# Altium schematic sheet Sheet1.SchDoc
size A3
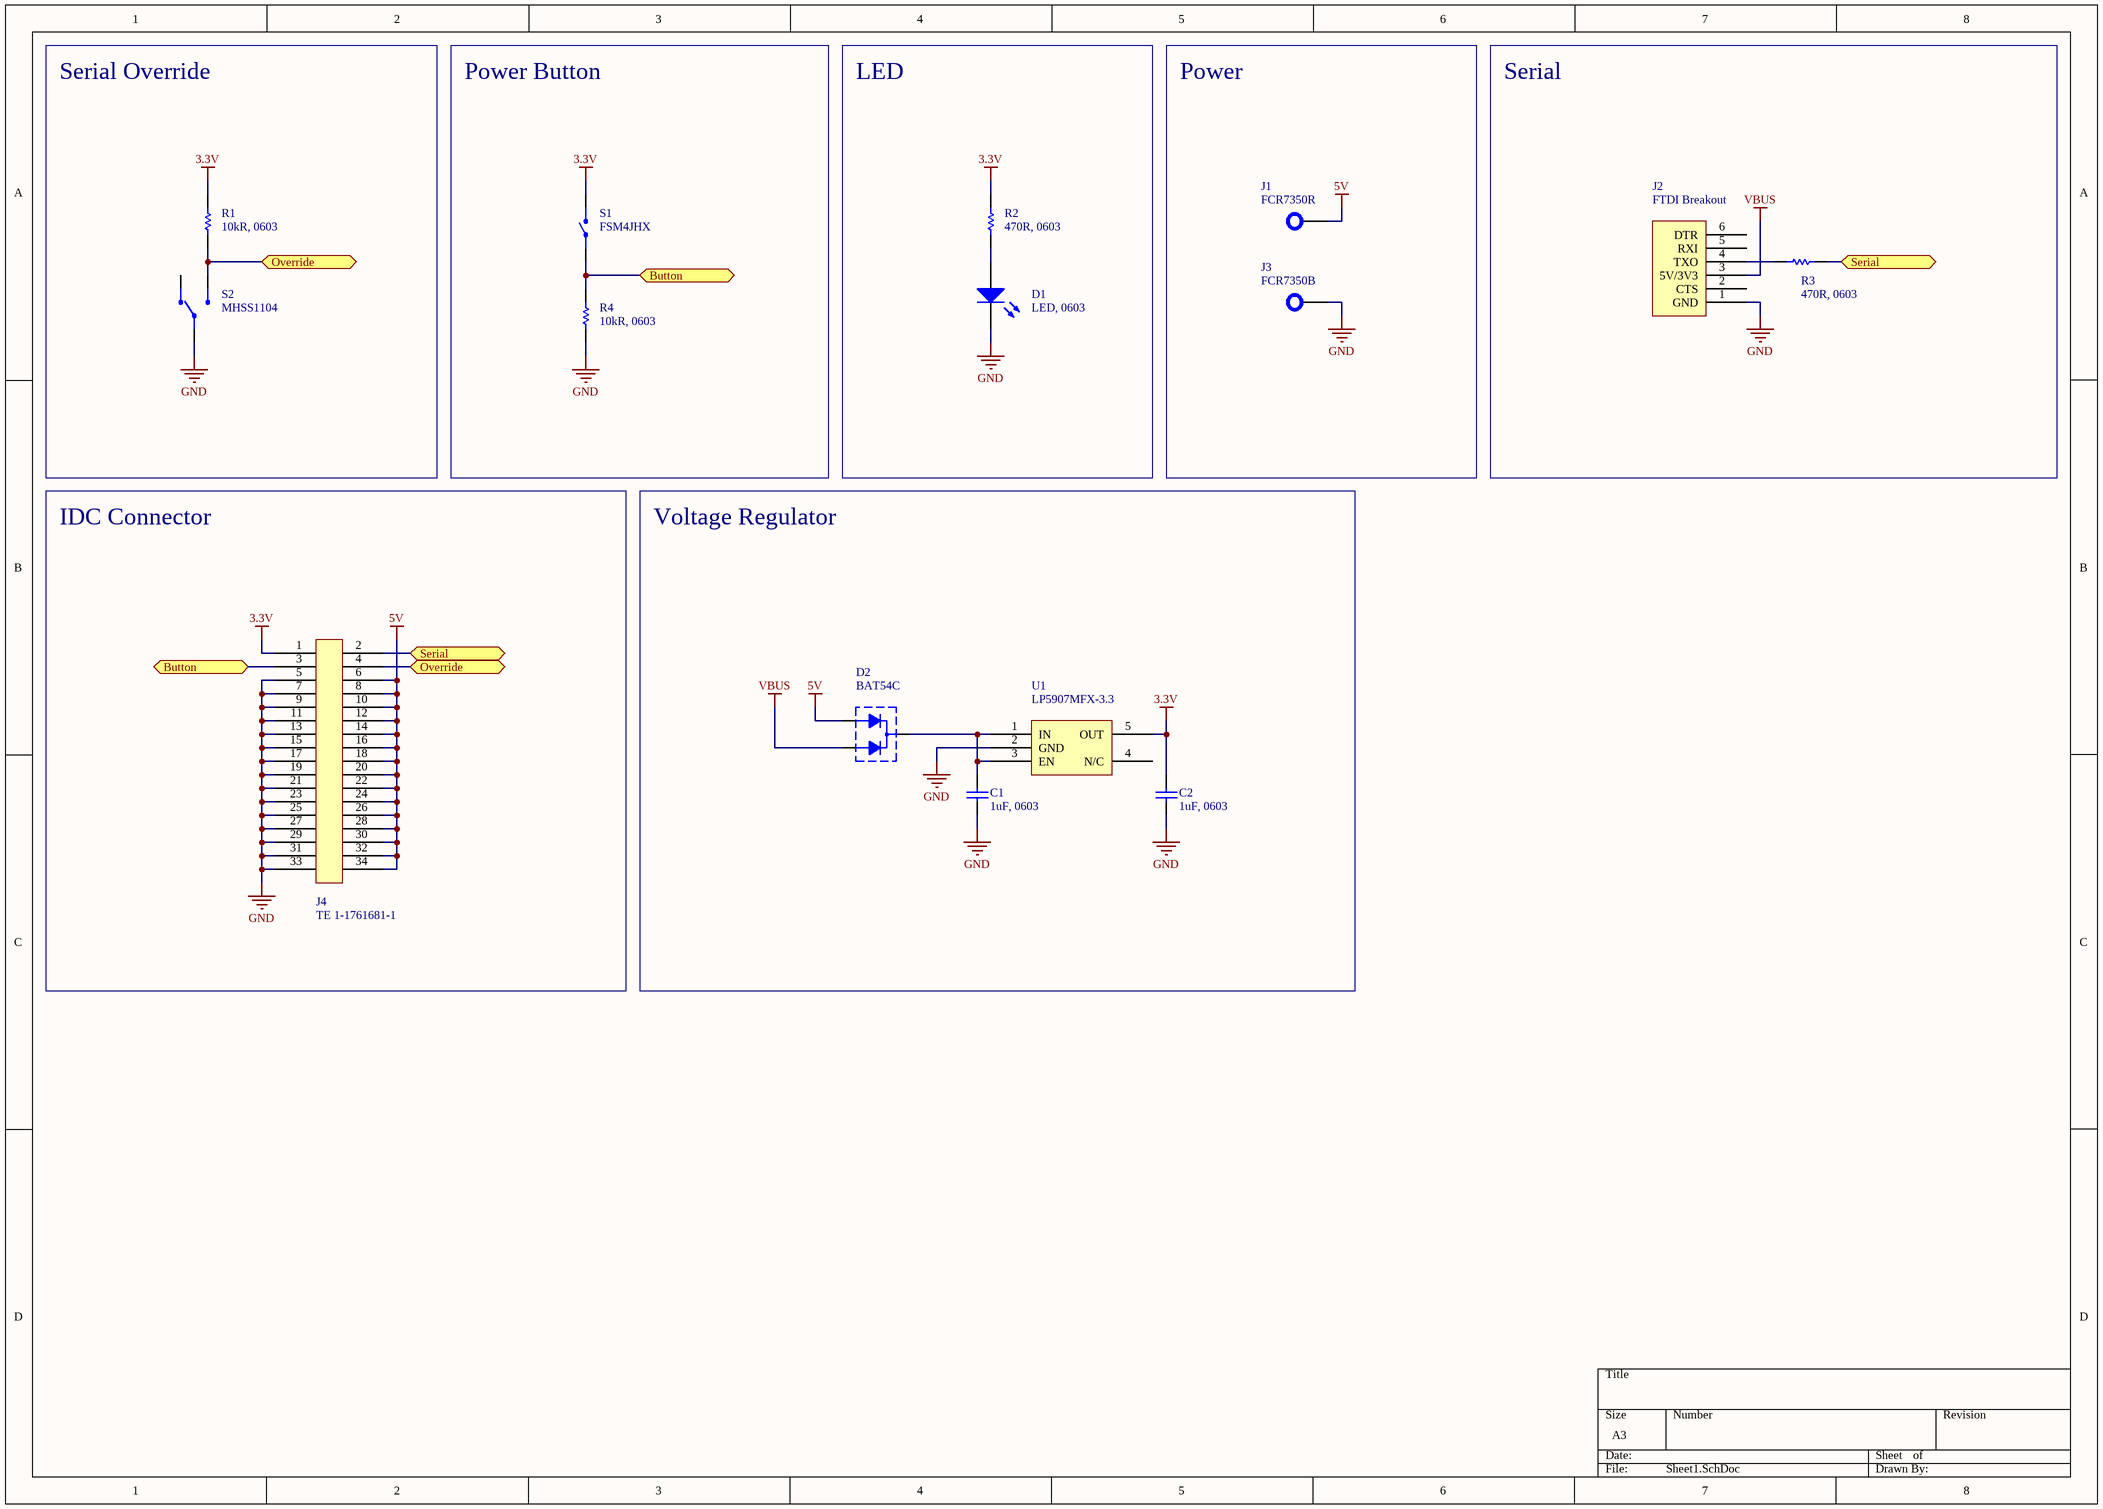
[diagram p0: Sheet1.SchDoc]

## Parts
C1  1uF, 0603  [Capacitor 0603]
C2  1uF, 0603  [Capacitor 0603]
D1  LED, 0603  [LED 0603]
D2  BAT54C  [SOT-23]
J1  FCR7350R  [FCR7350R]
J2  FTDI Breakout  [FTDI Breakout]
J3  FCR7350B  [FCR7350B]
J4  TE 1-1761681-1  [TE 1-1761681-1]
R1  10kR, 0603  [Resistor 0603]
R2  470R, 0603  [Resistor 0603]
R3  470R, 0603  [Resistor 0603]
R4  10kR, 0603  [Resistor 0603]
S1  FSM4JHX  [FSM4JHX]
S2  MHSS1104  [MHSS1104]
U1  LP5907MFX-3.3  [SOT-23-5]

## Blocks framed on the sheet
Serial Override: R1 S2
Power Button: R4 S1
LED: D1 R2
Power: J1 J3
Serial: J2 R3
IDC Connector: J4
Voltage Regulator: C1 C2 D2 U1

## Ports
Button, Override, Serial

## Nets
3.3V: C2.2 J4.1 R1.2 R2.2 S1.2 U1.5(OUT)
5V: D2.2(A2) J1.Signal J4.6 J4.8 J4.10 J4.12 J4.14 J4.16 J4.18 J4.20 J4.22 J4.24 J4.26 J4.28 J4.30 J4.32 J4.34
GND: C1.1 C2.1 D1.K J2.1(GND) J3.Signal J4.5 J4.7 J4.9 J4.11 J4.13 J4.15 J4.17 J4.19 J4.21 J4.23 J4.25 J4.27 J4.29 J4.31 J4.33 R4.1 S2.2 U1.2(GND)
VBUS: D2.1(A1) J2.3(5V/3V3)
Button: J4.3 R4.2 S1.1 ; port Button
Override: J4.4 R1.1 S2.3 ; port Override
Serial: J4.2 R3.1 ; port Serial
NetC1_2: C1.2 D2.3(K) U1.1(IN) U1.3(EN)
NetD1_A: D1.A R2.1
NetJ2_4: J2.4(TXO) R3.2

Not connected (* = marked no-connect by the designer): J2 2(CTS) 5(RXI) 6(DTR); S2 1; U1 4(N/C)

## Library data of the parts
C1 C2 = Capacitor
D1 = LED
J1 J3 = FCR7350x
R1-R4 = Resistor
S1 = Switch
S2 = Switch SPDT